# Altium schematic sheet Input.SchDoc
size A4
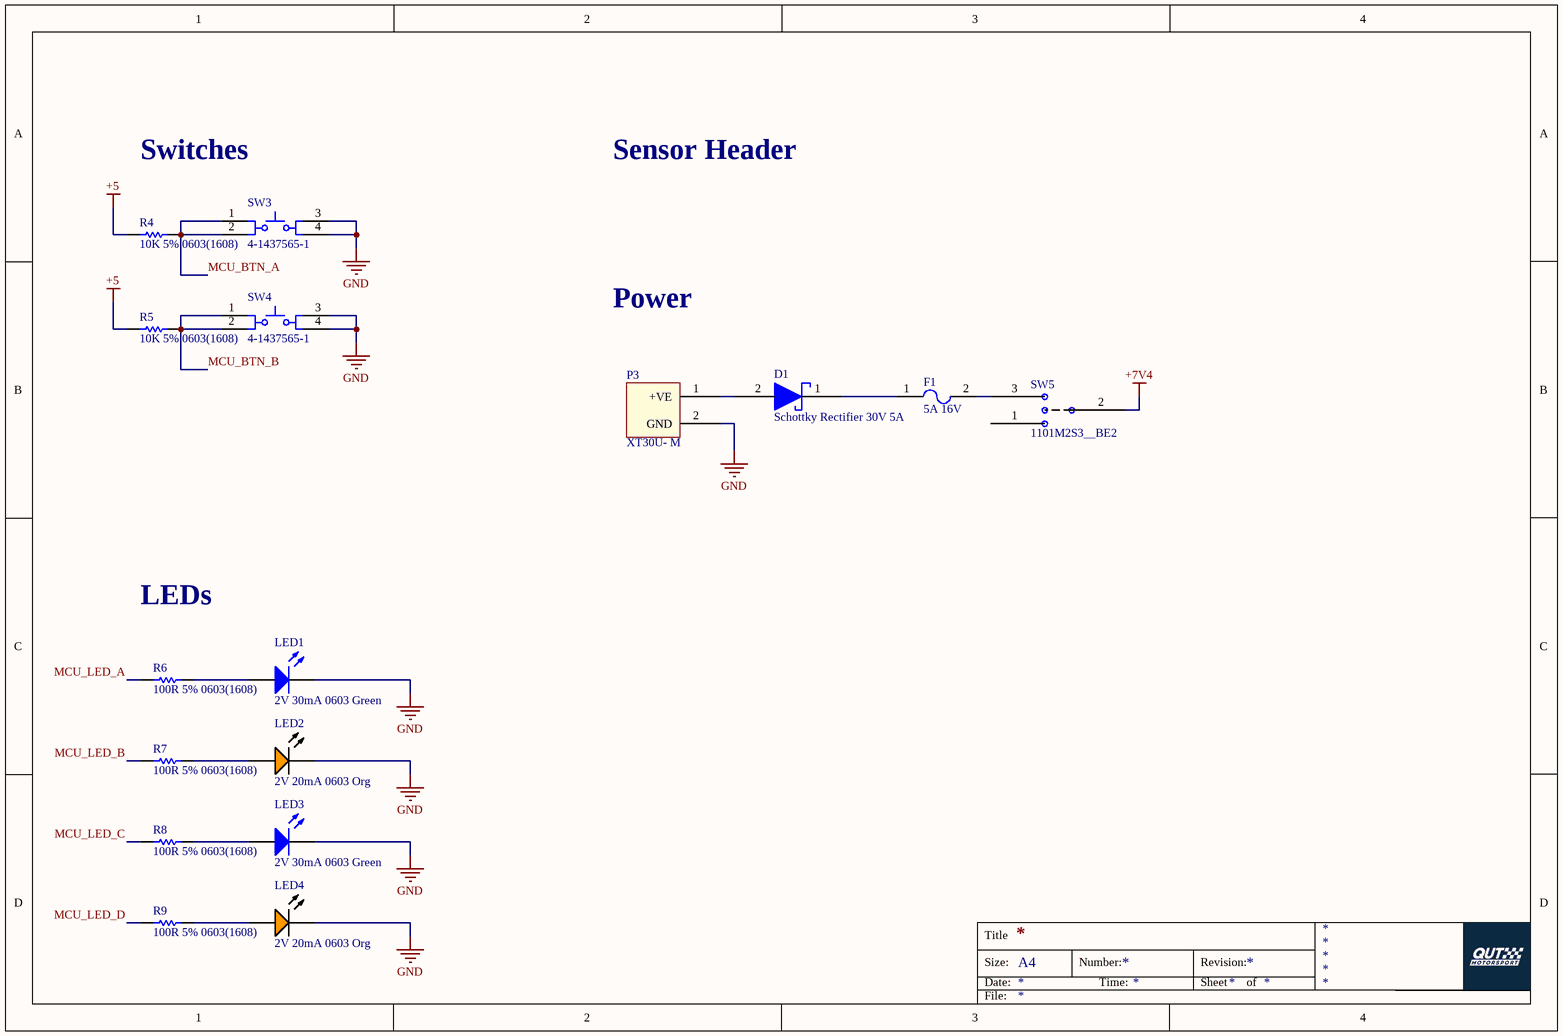
[diagram p0: Input.SchDoc]

## Parts
D1  Schottky Rectifier 30V 5A  [Schottky Diode 30V 5A]
F1  5A 16V  [Fuse 5A 16V 1812]
LED1  2V 30mA 0603 Green  [0603_A]
LED2  2V 20mA 0603 Org  [KING-LED0603-25-ORANGE_V]
LED3  2V 30mA 0603 Green  [0603_A]
LED4  2V 20mA 0603 Org  [KING-LED0603-25-ORANGE_V]
P3  XT30U- M  [XT30U-M]
R4  10K 5% 0603(1608)  [RESC0603(1608)_N]
R5  10K 5% 0603(1608)  [RESC0603(1608)_N]
R6  100R 5% 0603(1608)  [RESC0603(1608)_L]
R7  100R 5% 0603(1608)  [RESC0603(1608)_L]
R8  100R 5% 0603(1608)  [RESC0603(1608)_L]
R9  100R 5% 0603(1608)  [RESC0603(1608)_L]
SW3  4-1437565-1  [TECO-4-1437565-1_V]
SW4  4-1437565-1  [TECO-4-1437565-1_V]
SW5  1101M2S3__BE2  [1101M2S3__BE2]

## Nets
+5: R4.2 R5.2
+7V4: SW5.2
GND: LED1.1(K) LED2.2(K) LED3.1(K) LED4.2(K) P3.2(GND) SW3.3 SW3.4 SW4.3 SW4.4
MCU_BTN_A: R4.1 SW3.1 SW3.2
MCU_BTN_B: R5.1 SW4.1 SW4.2
MCU_LED_A: R6.1
MCU_LED_B: R7.2
MCU_LED_C: R8.1
MCU_LED_D: R9.2
NetD1_1: D1.1(K) F1.1
NetD1_2: D1.2(A) P3.1(+VE)
NetF1_2: F1.2 SW5.3
NetLED1_2: LED1.2(A) R6.2
NetLED2_1: LED2.1(A) R7.1
NetLED3_2: LED3.2(A) R8.2
NetLED4_1: LED4.1(A) R9.1

Not connected (* = marked no-connect by the designer): SW5 1

## Notes on the sheet
- Switches
- Sensor Header
- Power
- LEDs
- Title
- Size:
- Date:
- A4
- Number:
- Time:
- Revision:
- Sheet
- of
- File:

## Library data of the parts
F1 = Fuse 16V 5A 1812: ComponentLink1Description: Datasheet; ComponentLink1URL: https://www.bourns.com/docs/Product-Datasheets/mfmsmf.pdf; ComponentLink2Description: Supplier; ComponentLink2URL: https://www.digikey.com.au/product-detail/en/bourns-inc/MF-MSMF250-16X-2/MF-MSMF250-16X-2CT-ND/3437789
LED1 LED3 = CMP-1426-00006-1: SMD mono-color Chip LED, WL-SMCW, Bright Green; PartNumber: 150060VS75000; Manufacturer: Wuerth Elektronik; ComponentLink2URL: http://katalog.we-online.com/led/datasheet/150060VS75000.pdf; ComponentLink1Description: Manufacturer URL; PackageReference: 0603_A; ComponentLink2Description: Datasheet; ComponentLink1URL: http://www.we-online.com; Color: Bright Green
LED2 LED4 = CMP-0239-00002-1: LED, SMT, 0603(1608), 0.25mm Tthickness, Super Bright Orange; PartNumber: APG1608SEKC/T; Forward Current: 30 mA; Power Dissipation: 75 mW; Reverse Voltage: 5 V; Packing: Reel; PackageDescription: 2-Pin SMT LED, 1.6 x 0.8 mm Body, 0.25mm Thickness; ComponentLink1URL: http://www.kingbrightusa.com/; PackageVersion: Rev. 4A, 12/2011; Storage Temperature: -40 to 85 degC; Mounting Technology: Surface Mount; ComponentLink2Description: Datasheet; DatasheetVersion: Rev. 4A, 12/2011; ComponentLink2URL: http://www.kingbrightusa.com/images/catalog/SPEC/APG1608SEKC-T.pdf; PackageReference: LED0603-25-ORANGE; ComponentLink1Description: Manufacturer URL
R4 R5 = CMP-1012-00098-1: 10K 0.1W 5% 0603 (1608 Metric)  SMD; Case-EIA: 0603; Value: 10000.00 Ohm; Case-Metric: 1608; Technology: SMT; Tolerance: 5 %; Power: 0.1 W
R6-R9 = CMP-1012-00050-1: 100R 0.1W 5% 0603 (1608 Metric)  SMD; Case-EIA: 0603; Value: 100.00 Ohm; Case-Metric: 1608; Tolerance: 5 %; Technology: SMT; Power: 0.1 W
SW3 SW4 = CMP-2000-05602-1: Tactile Switch, 50 mA, 12 VDC, -20 to 85 degC, 4-Pin SMD, RoHS, Bulk; Manufacturer: TEConnectivity/AMPBrand; Illumination Type: N/R; Maximum Contact Resistance: 100mOhm; Actuator Style: RoundButton; Actuator Length: 1.4mm; Contact Rating @ Voltage: 0.05@12VDCA; Maximum DC Voltage Rating: 12V; Body Orientation: Straight; Ground Terminal: No; Dielectric Strength: 500VAC; Operating Force: 1.57N; Electrical Life: 100000Cycle; Mechanical Life: N/A; Family: FSMJSMA; Contact Material: CopperAlloy; Type: N/A; RoHS: Yes; Pole Throw Configuration: N/A; Operating Temperature: -20to85C; Minimum Insulation Resistance: 100MOhm; Package Description: 4-Pin Surface Mount Device, Body 6 x 6 mm, Pitch 9.1 mm; Housing Material: N/A; Switch Configuration: N/A; Mounting: SurfaceMount,GullWing; Datasheet URL: https://datasheet.ciiva.com/14635/0900766b80912216-14635826.pdf; Packaging: Bulk; Base Material: N/A; Actuator Color: N/A; Dimension: 6x10x5.25mm; Contact Plating: Silver; Seal Location: N/A; Mounting Technology: SurfaceMount; Part No: 4-1437565-1; Seal Description: N/A; Maximum AC Voltage Rating: N/A; Datasheet Version: 04/2007; Manufacturer URL: http://www.te.com/; Package Reference: 4-1437565-1; Product Weight: N/A
D1 = Schottky Rectifier 30V 5A: ComponentLink1Description: Datasheet; ComponentLink1URL: https://assets.nexperia.com/documents/data-sheet/PMEG3050EP.pdf